# Altium project Inj_measure.PrjPcb
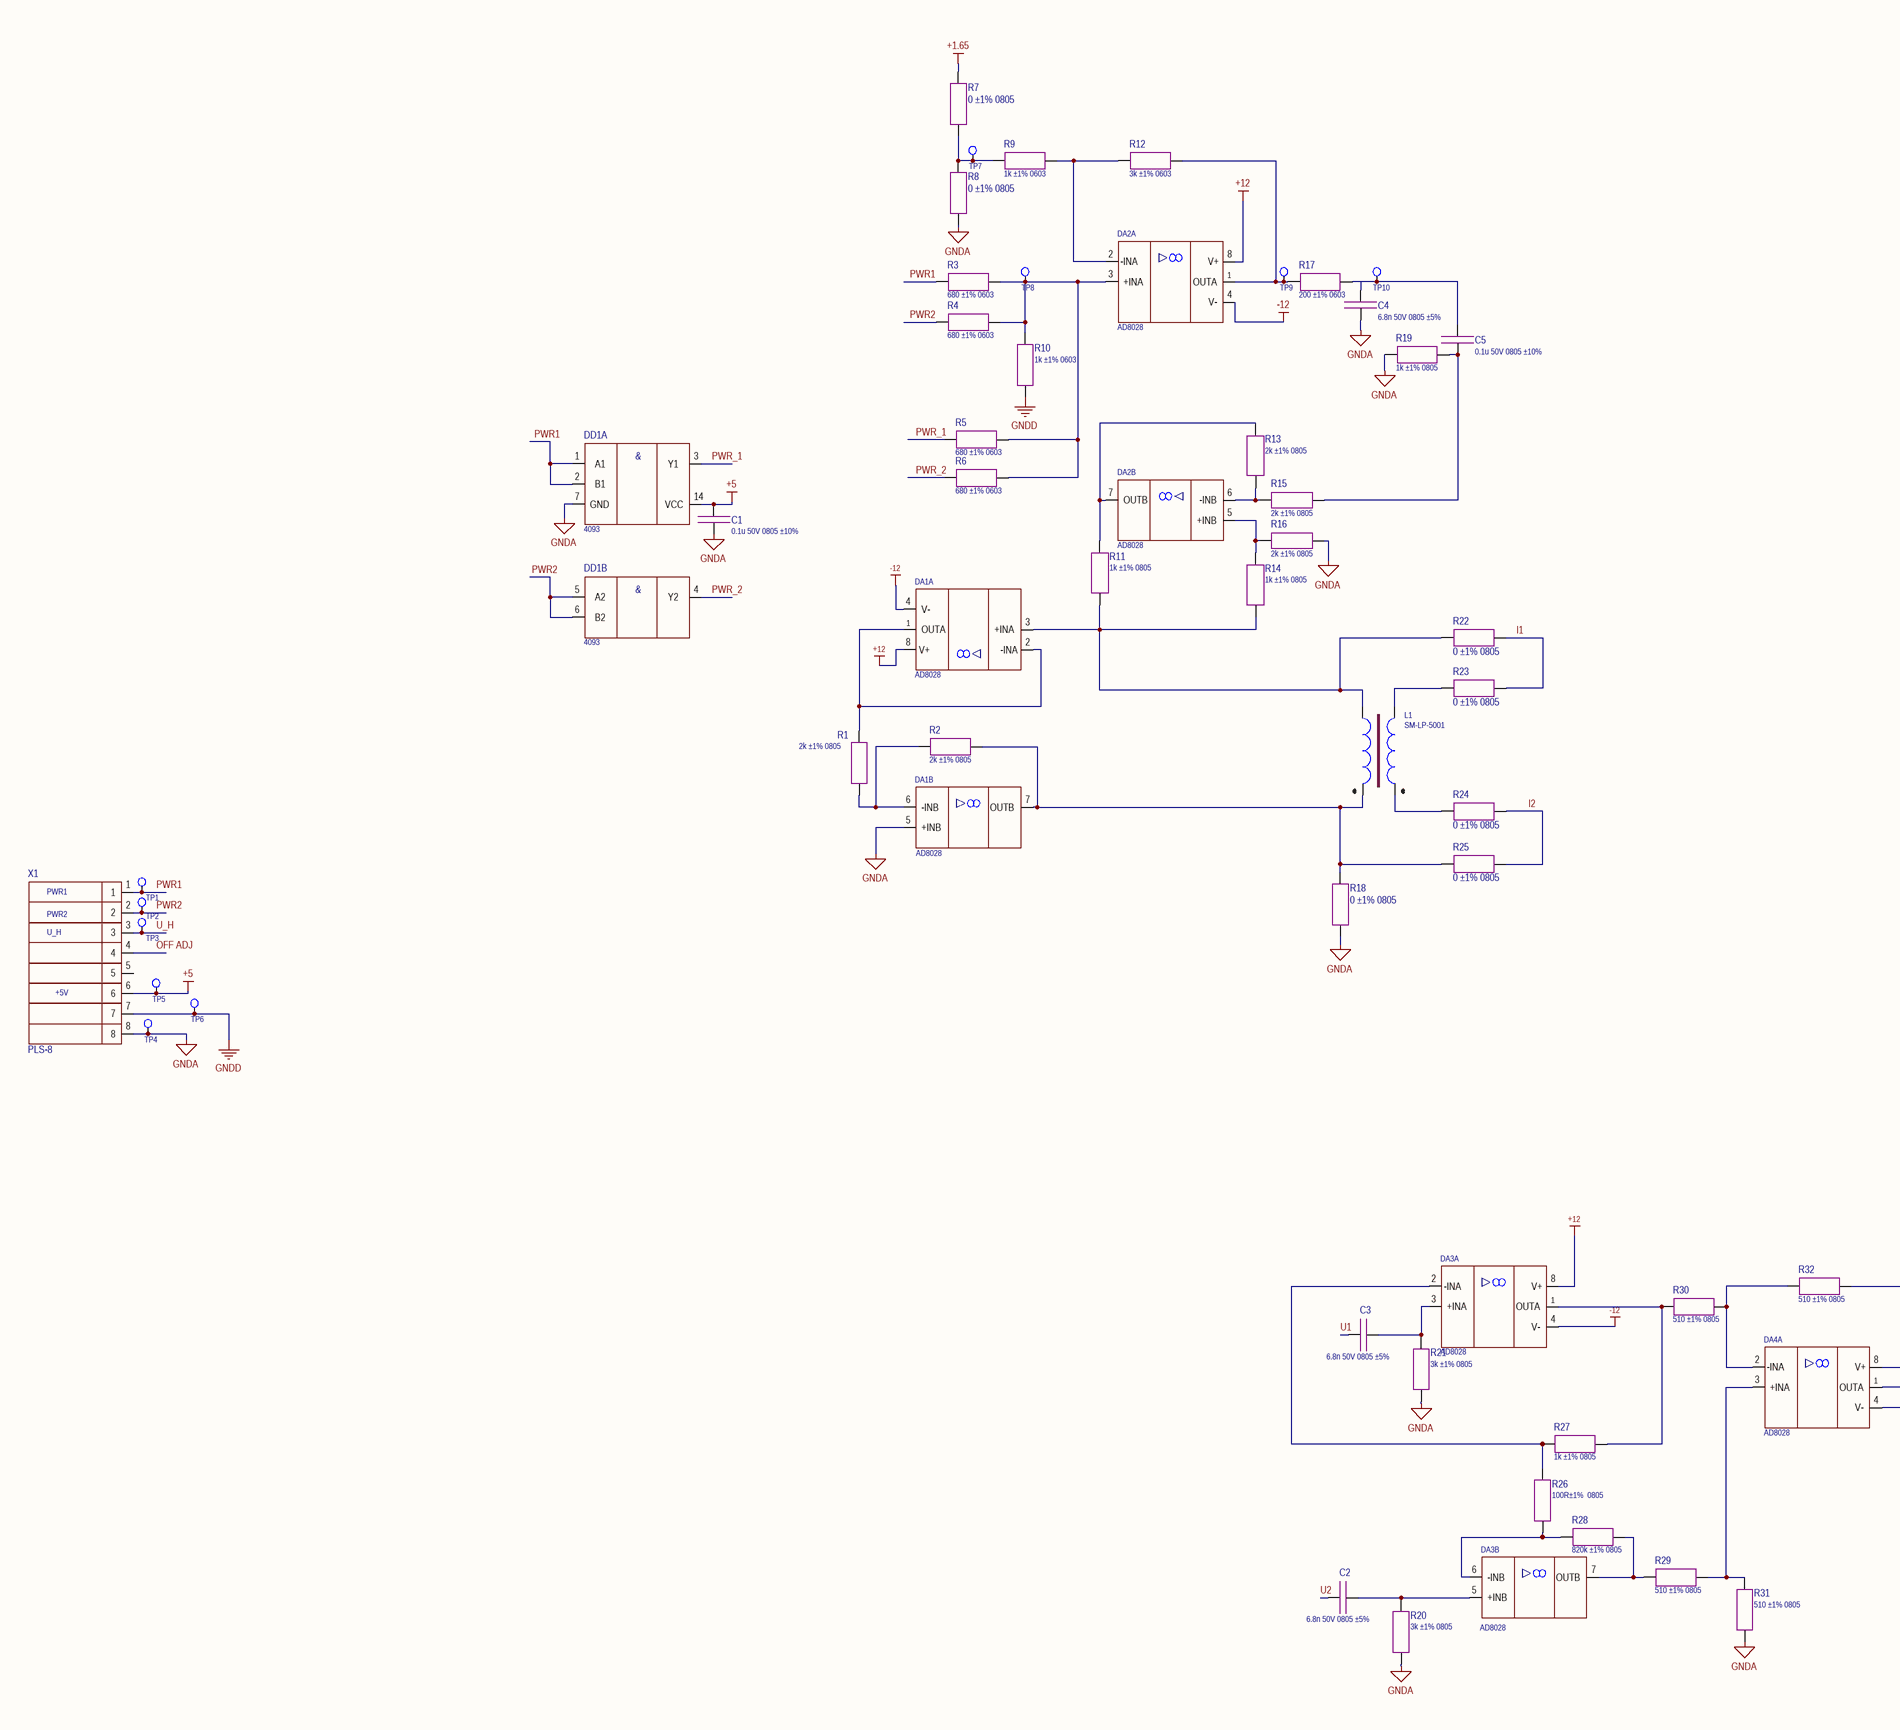
[diagram p0: inj_meas.SchDoc, left]
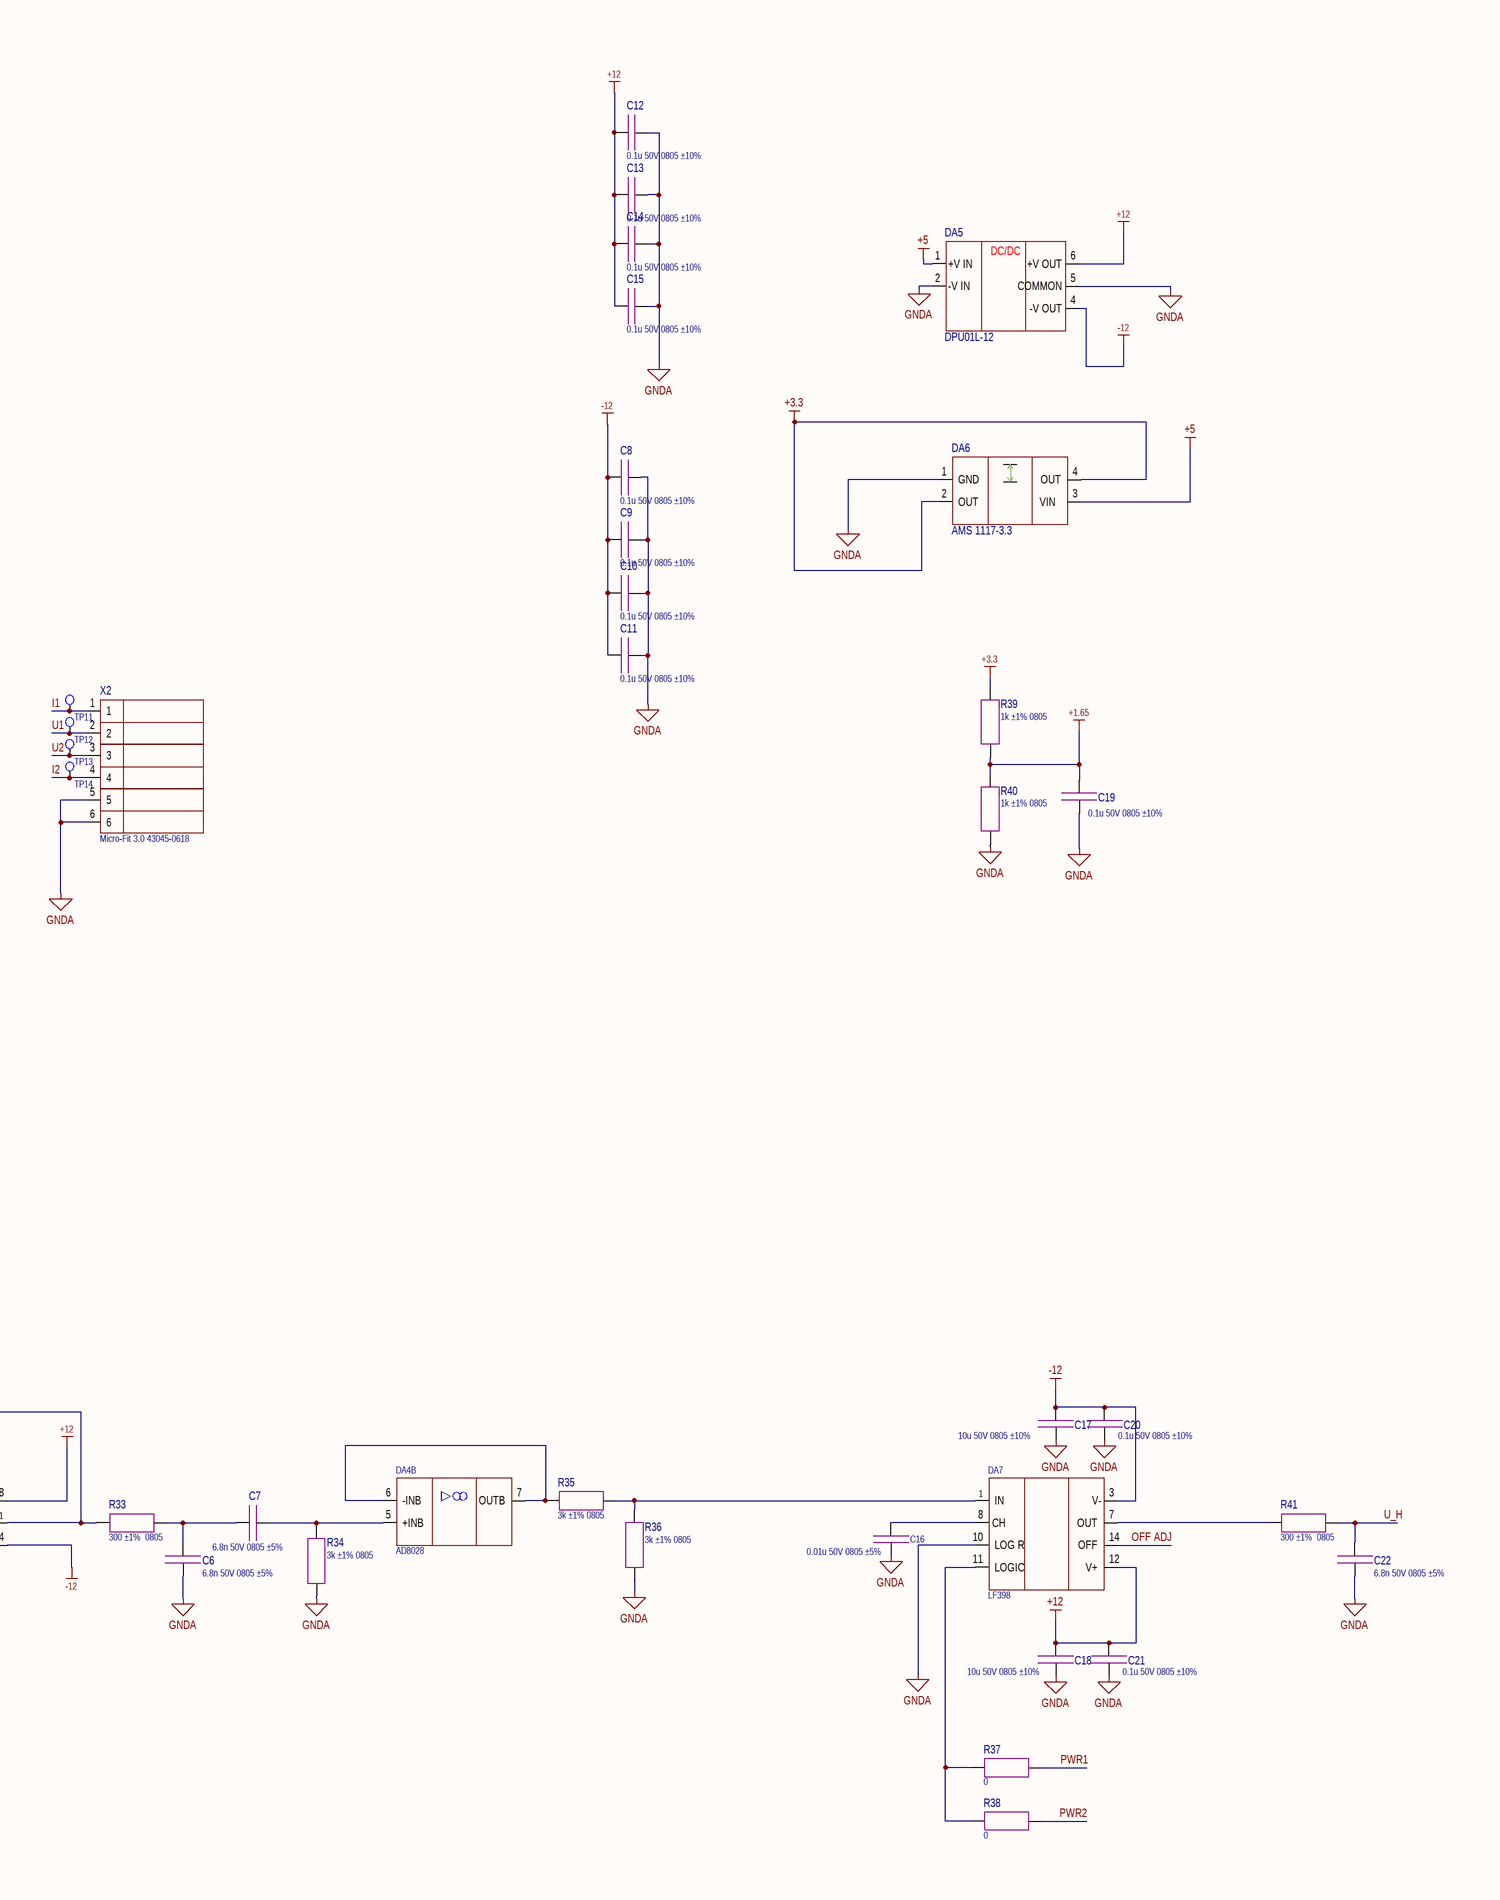
[diagram p1: inj_meas.SchDoc, right]
1 sheet, 88 parts. Net scope: global (net labels, ports and power ports of the same name join across sheets).
Board file: inj_meas.PcbDoc

## Sheet inj_meas.SchDoc
size 840 x 594 mm; SheetNumber: 1; SheetTotal: 1

### Parts
C1  0.1u 50V 0805 ±10%  [CAP: SMD 0805 MD IPC 782]
C2  6.8n 50V 0805 ±5%  [CAP: SMD 0805 MD IPC 782]
C3  6.8n 50V 0805 ±5%  [CAP: SMD 0805 MD IPC 782]
C4  6.8n 50V 0805 ±5%  [CAP: SMD 0805 MD IPC 782]
C5  0.1u 50V 0805 ±10%  [CAP: SMD 0805 MD IPC 782]
C6  6.8n 50V 0805 ±5%  [CAP: SMD 0805 MD IPC 782]
C7  6.8n 50V 0805 ±5%  [CAP: SMD 0805 MD IPC 782]
C8  0.1u 50V 0805 ±10%  [CAP: SMD 0805 MD IPC 782]
C9  0.1u 50V 0805 ±10%  [CAP: SMD 0805 MD IPC 782]
C10  0.1u 50V 0805 ±10%  [CAP: SMD 0805 MD IPC 782]
C11  0.1u 50V 0805 ±10%  [CAP: SMD 0805 MD IPC 782]
C12  0.1u 50V 0805 ±10%  [CAP: SMD 0805 MD IPC 782]
C13  0.1u 50V 0805 ±10%  [CAP: SMD 0805 MD IPC 782]
C14  0.1u 50V 0805 ±10%  [CAP: SMD 0805 MD IPC 782]
C15  0.1u 50V 0805 ±10%  [CAP: SMD 0805 MD IPC 782]
C16  0.01u 50V 0805 ±5%  [CAP: SMD 0805 MD IPC 782]
C17  10u 50V 0805 ±10%  [CAP: SMD 0805 MD IPC 782]
C18  10u 50V 0805 ±10%  [CAP: SMD 0805 MD IPC 782]
C19  0.1u 50V 0805 ±10%  [CAP: SMD 0805 MD IPC 782]
C20  0.1u 50V 0805 ±10%  [CAP: SMD 0805 MD IPC 782]
C21  0.1u 50V 0805 ±10%  [CAP: SMD 0805 MD IPC 782]
C22  6.8n 50V 0805 ±5%  [CAP: SMD 0805 MD IPC 782]
DA1  AD8028  [IC: SOIC 8]  (parts A,B of 2)
DA2  AD8028  [IC: SOIC 8]  (parts A,B of 2)
DA3  AD8028  [IC: SOIC 8]  (parts A,B of 2)
DA4  AD8028  [IC: SOIC 8]  (parts A,B of 2)
DA5  DPU01L-12  [SIP-6]
DA6  AMS 1117-3.3  [IC: SOT 223]
DA7  LF398  [IC: SOIC 14]
DD1  4093  [IC: SOIC 14]  (parts A,B of 4)
L1  SM-LP-5001  [IND: SM-LP-5001E]
R1  2k ±1% 0805  [RES: SMD 0805 MD IPC 782]
R2  2k ±1% 0805  [RES: SMD 0805 MD IPC 782]
R3  680 ±1% 0603  [RES: SMD 0603 MD IPC 782]
R4  680 ±1% 0603  [RES: SMD 0603 MD IPC 782]
R5  680 ±1% 0603  [RES: SMD 0603 MD IPC 782]
R6  680 ±1% 0603  [RES: SMD 0603 MD IPC 782]
R7  0 ±1% 0805  [RES: SMD 0805 MD IPC 782]
R8  0 ±1% 0805  [RES: SMD 0805 MD IPC 782]
R9  1k ±1% 0603  [RES: SMD 0603 MD IPC 782]
R10  1k ±1% 0603  [RES: SMD 0603 MD IPC 782]
R11  1k ±1% 0805  [RES: SMD 0805 MD IPC 782]
R12  3k ±1% 0603  [RES: SMD 0603 MD IPC 782]
R13  2k ±1% 0805  [RES: SMD 0805 MD IPC 782]
R14  1k ±1% 0805  [RES: SMD 0805 MD IPC 782]
R15  2k ±1% 0805  [RES: SMD 0805 MD IPC 782]
R16  2k ±1% 0805  [RES: SMD 0805 MD IPC 782]
R17  200 ±1% 0603  [RES: SMD 0603 MD IPC 782]
R18  0 ±1% 0805  [RES: SMD 0805 MD IPC 782]
R19  1k ±1% 0805  [RES: SMD 0805 MD IPC 782]
R20  3k ±1% 0805  [RES: SMD 0805 MD IPC 782]
R21  3k ±1% 0805  [RES: SMD 0805 MD IPC 782]
R22  0 ±1% 0805  [RES: SMD 0805 MD IPC 782]
R23  0 ±1% 0805  [RES: SMD 0805 MD IPC 782]
R24  0 ±1% 0805  [RES: SMD 0805 MD IPC 782]
R25  0 ±1% 0805  [RES: SMD 0805 MD IPC 782]
R26  100R±1%  0805  [RES: SMD 0805 MD IPC 782]
R27  1k ±1% 0805  [RES: SMD 0805 MD IPC 782]
R28  820k ±1% 0805  [RES: SMD 0805 MD IPC 782]
R29  510 ±1% 0805  [RES: SMD 0805 MD IPC 782]
R30  510 ±1% 0805  [RES: SMD 0805 MD IPC 782]
R31  510 ±1% 0805  [RES: SMD 0805 MD IPC 782]
R32  510 ±1% 0805  [RES: SMD 0805 MD IPC 782]
R33  300 ±1%  0805  [RES: SMD 0805 MD IPC 782]
R34  3k ±1% 0805  [RES: SMD 0805 MD IPC 782]
R35  3k ±1% 0805  [RES: SMD 0805 MD IPC 782]
R36  3k ±1% 0805  [RES: SMD 0805 MD IPC 782]
R37  0  [RES: SMD 0603 MD IPC 782]
R38  0  [RES: SMD 0603 MD IPC 782]
R39  1k ±1% 0805  [RES: SMD 0805 MD IPC 782]
R40  1k ±1% 0805  [RES: SMD 0805 MD IPC 782]
R41  300 ±1%  0805  [RES: SMD 0805 MD IPC 782]
TP1  Test point  [Test Point]  (value not drawn)  (net tie)
TP2  Test point  [Test Point]  (value not drawn)  (net tie)
TP3  Test point  [Test Point]  (value not drawn)  (net tie)
TP4  Test point  [Test Point]  (value not drawn)  (net tie)
TP5  Test point  [Test Point]  (value not drawn)  (net tie)
TP6  Test point  [Test Point]  (value not drawn)  (net tie)
TP7  Test point  [Test Point]  (value not drawn)  (net tie)
TP8  Test point  [Test Point]  (value not drawn)  (net tie)
TP9  Test point  [Test Point]  (value not drawn)  (net tie)
TP10  Test point  [Test Point]  (value not drawn)  (net tie)
TP11  Test point  [Test Point]  (value not drawn)  (net tie)
TP12  Test point  [Test Point]  (value not drawn)  (net tie)
TP13  Test point  [Test Point]  (value not drawn)  (net tie)
TP14  Test point  [Test Point]  (value not drawn)  (net tie)
X1  PLS-8  [CON: 8PIN PLS-8]
X2  Micro-Fit 3.0 43045-0618  [CON: 6pin Molex MicroFit 3.0 43045-0618]

### Nets
+1.65: C19.1 R7.2 R39.1 R40.2
+3.3: DA6.2(OUT) DA6.4(OUT) R39.2
+5: C1.1 DA5.1(+V_IN) DA6.3(VIN) DD1.14(VCC) TP5.1 X1.6
+12: C12.2 C13.2 C14.2 C15.2 C18.1 C21.1 DA1.8(V+) DA2.8(V+) DA3.8(V+) DA4.8(V+) DA5.6(+V_OUT) DA7.12(V+)
-12: C8.2 C9.2 C10.2 C11.2 C17.1 C20.1 DA1.4(V-) DA2.4(V-) DA3.4(V-) DA4.4(V-) DA5.4(-V_OUT) DA7.3(V-)
GNDA: C1.2 C4.2 C6.2 C8.1 C9.1 C10.1 C11.1 C12.1 C13.1 C14.1 C15.1 C16.2 C17.2 C18.2 C19.2 C20.2 C21.2 C22.2 DA1.5(+INB) DA5.2(-V_IN) DA5.5(COMMON) DA6.1(GND) DA7.10(LOG_R) DD1.7(GND) R8.1 R16.2 R18.1 R19.1 R20.2 R21.2 R31.1 R34.2 R36.1 R40.1 TP4.1 X1.8 X2.5 X2.6
GNDD: R10.1 TP6.1 X1.7
I1: R22.2 R23.2 TP11.1 X2.1
I2: R24.2 R25.2 TP14.1 X2.4
OFF ADJ: DA7.14(OFF) X1.4
PWR1: DD1.1(A1) DD1.2(B1) R3.1 R37.2 TP1.1 X1.1
PWR2: DD1.5(A2) DD1.6(B2) R4.1 R38.2 TP2.1 X1.2
PWR_1: DD1.3(Y1) R5.1
PWR_2: DD1.4(Y2) R6.1
U1: C3.2 TP12.1 X2.2
U2: C2.2 TP13.1 X2.3
U_H: C22.1 R41.2 TP3.1 X1.3
NetC2_1: C2.1 DA3.5(+INB) R20.1
NetC3_1: C3.1 DA3.3(+INA) R21.1
NetC4_1: C4.1 C5.2 R17.2 TP10.1
NetC5_1: C5.1 R15.2 R19.2
NetC6_1: C6.1 C7.2 R33.2
NetC7_1: C7.1 DA4.5(+INB) R34.1
NetC16_1: C16.1 DA7.8(CH)
NetDA1_1: DA1.1(OUTA) DA1.2(-INA) R1.1
NetDA1_3: DA1.3(+INA) L1.4 R11.2 R14.1 R22.1
NetDA1_6: DA1.6(-INB) R1.2 R2.1
NetDA1_7: DA1.7(OUTB) L1.1 R2.2 R18.2 R25.1
NetDA2_1: DA2.1(OUTA) R12.2 R17.1 TP9.1
NetDA2_2: DA2.2(-INA) R9.2 R12.1
NetDA2_3: DA2.3(+INA) R3.2 R4.2 R5.2 R6.2 R10.2 TP8.1
NetDA2_5: DA2.5(+INB) R14.2 R16.1
NetDA2_6: DA2.6(-INB) R13.2 R15.1
NetDA2_7: DA2.7(OUTB) R11.1 R13.1
NetDA3_1: DA3.1(OUTA) R27.1 R30.1
NetDA3_2: DA3.2(-INA) R26.2 R27.2
NetDA3_6: DA3.6(-INB) R26.1 R28.2
NetDA3_7: DA3.7(OUTB) R28.1 R29.1
NetDA4_1: DA4.1(OUTA) R32.2 R33.1
NetDA4_2: DA4.2(-INA) R30.2 R32.1
NetDA4_3: DA4.3(+INA) R29.2 R31.2
NetDA4_6: DA4.6(-INB) DA4.7(OUTB) R35.1
NetDA7_1: DA7.1(IN) R35.2 R36.2
NetDA7_7: DA7.7(OUT) R41.1
NetDA7_11: DA7.11(LOGIC) R37.1 R38.1
NetL1_2: L1.2 R24.1
NetL1_3: L1.3 R23.1
NetR7_1: R7.1 R8.2 R9.1 TP7.1

Not connected (* = marked no-connect by the designer): X1 5

### Notes on the sheet
- PWR1
- PWR2
- U_H
- +5V
- Перв. примен.
- Справ. №
- Подп. и дата
- Инв. № дубл.
- Взам. инв. №
- Разраб.
- Изм.
- Лист
- № докум.
- Подп.
- Дата
- Лит.
- Масса
- Масштаб
- Пров.
- Т.контр.
- Листов
- Инв. № подл.
- Утв.
- Н.контр.
- 2.106-A1
- Копировал
- Формат А1
- (in symbol DC-DC: +12/-12V DPU01L-12) DC/DC

### Library data of the parts
C1 C5 C8-C15 C19-C21 = 0.1u 50V 0805 ±10%: Code: 6279254871; Name: Конденсатор X7R 50V 0,1uF ±10% 0805
C2-C4 C6 C7 C22 = 6.8n 50V 0805 ±5%: Code: 6279352311; Name: Конденсатор NPO 50V 6800pF ±5% 0805
C16 = 0.01u 50V 0805 ±5%: Code: 6279261451; Name: Конденсатор X7R 50V  0,01uF±5%  0805
C17 C18 = 10u 50V 0805 ±10%: Code: 6289735441; Name: Конденсатор 12065D106KAT2A, AVX
DA1-DA4 = AD8028_part
DA5 = DC-DC: +12/-12V DPU01L-12: Code: 6339113551; Name: Микросхема AM2D-0512DZ, AIMTEC
DA6 = LDO: 15-3.3V AMS1117: Code: 6339112951; Name: Микросхема AMS-1117-3.3
DA7 = LF398MX
DD1 = LOGIC: 4093: &; Code: 6330002931; Name: Микросхема IW4093BD, ТУ РБ 14513714.005-03-95
R1 R2 R13 R15 R16 = 2k ±1% 0805: Code: 6094352561; Name: Резистор 2k±1%  0805
R3-R6 = 680 ±1% 0603: Code: 6069180761; Name: Резистор 680R ±1% 0603
R7 R8 R18 R22-R25 = 0 ±1% 0805: Code: 6094342239; Name: Резистор 0R ±1% 0805
R9 R10 = 1k ±1% 0603: Code: 6069174188; Name: Резистор 1k ±1% 0603
R11 R14 R19 R27 R39 R40 = 1k ±1% 0805: Code: 6027158691; Name: Резистор RC0805FR-071KL, Yageo
R12 = 3k ±1% 0603: Code: 6094357331; Name: Резистор 3К ±1% 0603
R17 = 200 ±1% 0603: Code: 6069180621; Name: Резистор 200R±1% 0603
R20 R21 R34-R36 = 3k ±1% 0805: Code: 6094357331; Name: Резистор 3К ±1% 0805
R26 = 100 ±1%  0805: Code: 6094351171; Name: Резистор 100R±1%  0805
R28 = 820k ±1% 0805: Code: 6019041741; Name: Резистор RC0805FR-07820KL, Yageo
R29-R32 = 510 ±1% 0805: Code: 6069137191; Name: Резистор 510R±1%  0805
R33 R41 = 300 ±1%  0805: Code: 6094357025; Name: Резистор 300R±1%  0805
R37 R38 = 0 ±5%: Code: 6020004221; Name: Резистор RC0603JR-070RL, Yageo
X1 = 8 pin PLS 8
X2 = 6 pin MicroFit DR SMD Molex: Code: 6319206231; Name: Вилка Micro-Fit 3.0 43045-0618, Molex